# EAGLE design soil temp v0.1 (EAGLE 9.2.2)
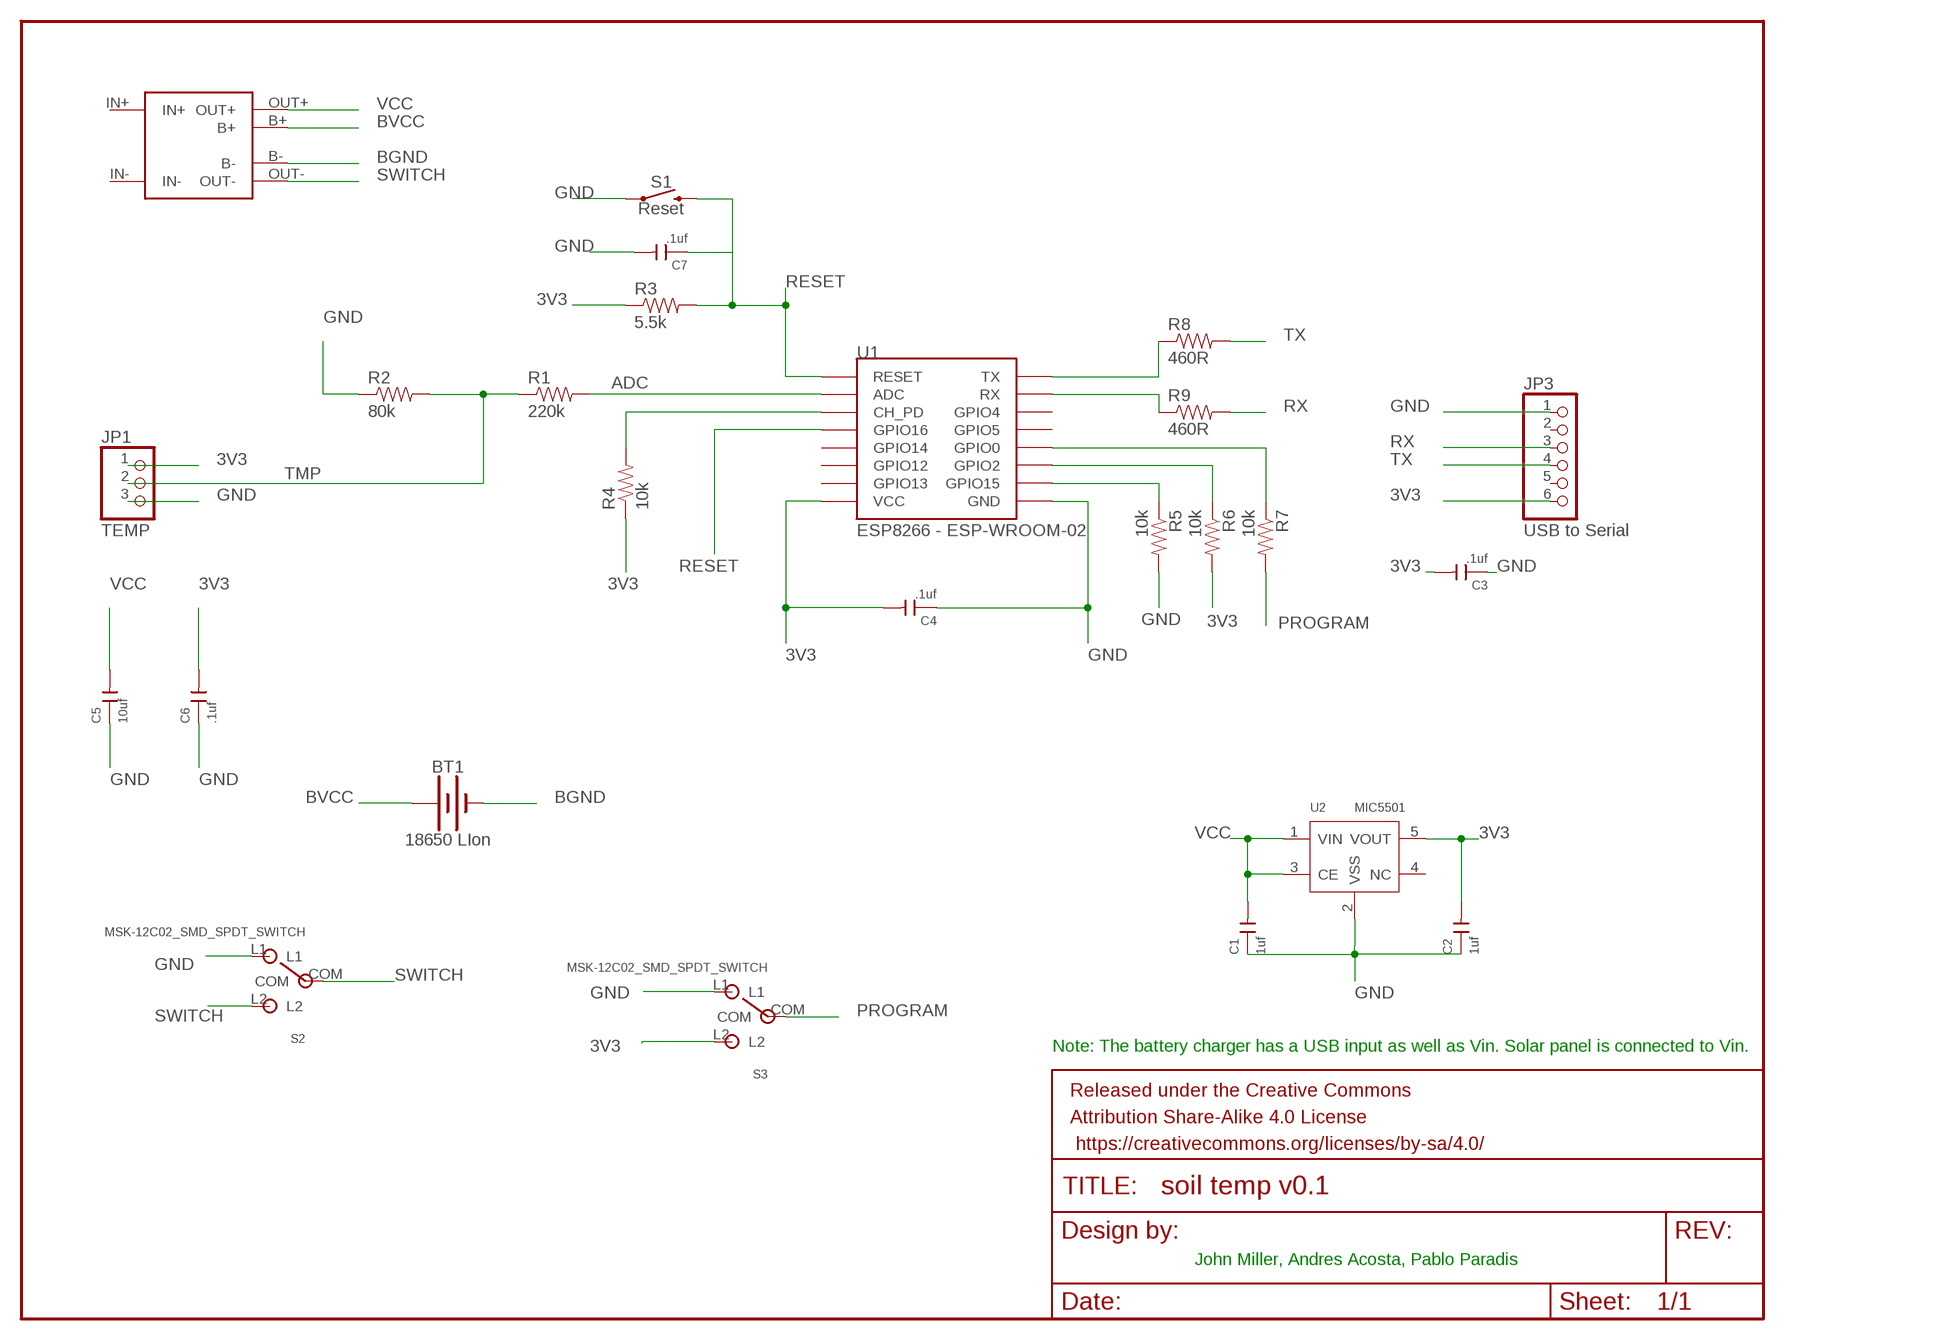
[diagram p0: schematic, sheet 1]

## Parts
BT1  18650 LIon  BATTERY-18650  [BATTERY_18650-HOLDER]
C1  1uf  CERAMIC-1UF-25V-10%-X7R(0805)  [C0805]
C2  1uf  CERAMIC-1UF-25V-10%-X7R(0805)  [C0805]
C3  .1uf  CERAMIC-1UF-25V-10%-X7R(0805)  [C0805]
C4  .1uf  CERAMIC-1UF-25V-10%-X7R(0805)  [C0805]
C5  10uf  CERAMIC-1UF-25V-10%-X7R(0805)  [C0805]
C6  .1uf  CERAMIC-1UF-25V-10%-X7R(0805)  [C0805]
C7  .1uf  CERAMIC-1UF-25V-10%-X7R(0805)  [C0805]
FRAME1  FRAME-LETTERNO_PACKAGE  [DUMMY]
JP1  TEMP  PINHD-1X3  [1X03]
JP3  USB to Serial  PINHD-1X6/90  [1X06/90]
R1  220k  RESISTOR0805  [R0805]
R2  80k  RESISTOR0805  [R0805]
R3  5.5k  RESISTOR0805  [R0805]
R4  10k  RESISTOR0805  [R0805]
R5  10k  RESISTOR0805  [R0805]
R6  10k  RESISTOR0805  [R0805]
R7  10k  RESISTOR0805  [R0805]
R8  460R  RESISTOR0805  [R0805]
R9  460R  RESISTOR0805  [R0805]
S1  Reset  MOMENTARY-SWITCH-SPST-SMD-6.2MM-TALL  [TACTILE_SWITCH_SMD_6.2MM_TALL]
S2  MSK-12C02_SMD_SPDT_SWITCH  [MSK-12C02]
S3  MSK-12C02_SMD_SPDT_SWITCH  [MSK-12C02]
U1  ESP8266 - ESP-WROOM-02  ESP12  [ESP12]
U2  MIC5501  PMIC-LDO-XC6204B332MR(SOT23-5)  [SOT-23-5]
U3  TP4056-MODULE  [TP4056-LITHIUM-PROTECTED-MODULE]

## Nets
3V3: C2.2 C3.2 C4.2 C6.2 JP1.1 JP3.6 R3.1 R4.1 R6.2 S3.L2 U1.VCC U2.5(VOUT)
ADC: R1.2 U1.ADC
BGND: BT1.GND@1(-) U3.B-
BVCC: BT1.PWR@1(+) U3.B+
GND: C1.1 C2.1 C3.1 C4.1 C5.1 C6.1 C7.2 JP1.3 JP3.1 R2.1 R5.2 S1.A2 S2.L1 S3.L1 U1.GND U2.2(VSS)
N$1: R4.2 U1.CH_PD
N$2: R5.1 U1.GPIO15
N$3: R6.1 U1.GPIO2
N$4: R7.1 U1.GPIO0
PROGRAM: R7.2 S3.COM
R2RX: R9.1 U1.RX
R2TX: R8.1 U1.TX
RESET: C7.1 R3.2 S1.B2 U1.GPIO16 U1.RESET
RX: JP3.3 R9.2
SWITCH: S2.COM S2.L2 U3.OUT-
TMP: JP1.2 R1.1 R2.2
TX: JP3.4 R8.2
VCC: C1.2 C5.2 U2.1(VIN) U2.3(CE) U3.OUT+
Unconnected: JP3.2 JP3.5 U1.GPIO4 U1.GPIO5 U1.GPIO12 U1.GPIO13 U1.GPIO14 U2.4(NC)

## Notes on the sheet
- Note: The battery charger has a USB input as well as Vin. Solar panel is connected to Vin.
- John Miller, Andres Acosta, Pablo Paradis

## Power pins joined to a net without a drawn wire
IN+: U3.IN+
IN-: U3.IN-

## Library data of the parts
BT1 = SparkFun-Batteries:BATTERY: Battery - Single Cell A variety of battery chemistries, sizes, and footprints. Device List: 20MM_PTH - Coin Cell Battery Holder - 20mm (PTH) <https://www.sparkfun.com/products/783> 6.8MM_PTH - Coin Cell Battery Holder - 6.8MM(SMD) <https://www.digikey.com/product-detail/en/seiko-instruments/MS621FE-FL11E/728-1057-ND/1889208?WT.srch=1&gclid=CNOQ5a6LzdQCFZS2wAodXCkE0g> 12MM_SMD - Coin Cell Battery Holder - 12mm (SMD) <https://www.sparkfun.com/products/10592> 12MM_PTH - Coin Cell Battery Holder - 12mm (PTH) <https://www.sparkfun.com/products/7948> 20MM_SMD - 20mm Coin Cell Battery Holder (SMD) (2 legs) Used on the Big Time Watch Kit <https://www.sparkfun.com/products/11734> 20MM_SMD_4LEGS - Coin Cell Battery Holder - 20mm (SMD) <https://www.sparkfun.com/products/11892> 20MM_SMD_4LEGS_OVERPASTE - Coin Cell Battery Holder - 20mm (SMD) <https://www.sparkfun.com/products/11892> (Over-paste on the legs) 24.5MM_PTH - Coin Cell Battery Holder - 24.5mm (PTH) <https://www.sparkfun.com/products/8863> 9V - 9V Battery Holder - PC Mount Used on the SparkFun SparkPunk Sound Kit <https://www.sparkfun.com/products/11177> and SparkFun SparkPunk Sequencer Kit <https://www.sparkfun.com/products/12707> 18650 - Battery Holder - 18650 (PTH) <https://www.sparkfun.com/products/13113> AA - Battery Holder - 1xAA (PTH) <https://www.sparkfun.com/products/7949> AAA - Battery Holder - 1xAAA (PTH) <https://www.sparkfun.com/products/12718> AA_KIT - Battery Holder - 1xAA (PTH) <https://www.sparkfun.com/products/7949> Special kit package - pads only have exposed copper on one side of the board. AAA_KIT - Battery Holder - 1xAAA (PTH) <https://www.sparkfun.com/products/12718> Special kit package - pads only have exposed copper on one side of the board.; PROD_ID: BATT-12327; SF_SKU: PRT-13113
C1 C2 = Seeed-Capacitor:CERAMIC-1UF-25V-10%-X7R(0805): 302010179; MPN: CC0805KKX7R8BB105
C3-C7 = Seeed-Capacitor:CERAMIC-1UF-25V-10%-X7R(0805): 302010179; MPN: CC0805KKX7R8BB105; VALUE: 1uf
FRAME1 = SparkFun-Aesthetics:FRAME-LETTER: Schematic Frame - Letter Standard 8.5x11 US Letter frame; DESIGNER: Nobody; VERSION: v01
JP1 = pinhead:PINHD-1X3: PIN HEADER
JP3 = pinhead:PINHD-1X6: PIN HEADER
R1-R9 = BeagleBone_Blue_R3:RESISTOR
S1 = SparkFun-Switches:MOMENTARY-SWITCH-SPST: Momentary Switch (Pushbutton) - SPST Normally-open (NO) SPST momentary switches (buttons, pushbuttons). Variants PTH-12MM - 12mm square, through-hole Momentary Pushbutton Switch - 12mm Square <https://www.sparkfun.com/products/9190> (COM-09190) PTH-6.0MM, PTH-6.0MM-KIT - 6.0mm square, through-hole Mini Pushbutton Switch <https://www.sparkfun.com/products/97> (COM-00097) KIT package intended for soldering kit's - only one side of pads' copper is exposed. PTH-RIGHT-ANGLE-KIT - Right-angle, through-hole Right Angle Tactile Button <https://www.sparkfun.com/products/10791> - Used on SparkFun BigTime Watch Kit <https://www.sparkfun.com/products/11734> SMD-12MM - 12mm square, surface-mount Tactile Button - SMD (12mm) <https://www.sparkfun.com/products/12993> (COM-12993) Used on SparkFun PicoBoard <https://www.sparkfun.com/products/11888> SMD-4.5MM - 4.5mm Square Trackball Switch Used on SparkFun Blackberry Trackballer Breakout <https://www.sparkfun.com/products/13169> SMD-4.6MMX2.8MM - 4.60mm x 2.80mm, surface mount Used on SparkFun SAMD21 Mini Breakout <https://www.sparkfun.com/products/13664> SMD-5.2MM, SMD-5.2-REDUNDANT - 5.2mm square, surface-mount Mini Pushbutton Switch - SMD <https://www.sparkfun.com/products/8720> (COM-08720) Used on Arduino Pro Mini <https://www.sparkfun.com/products/11114> REDUNDANT package connects both switch circuits together SMD-6.0X3.5MM - 6.0 x 3.5mm, surface mount Momentary Reset Switch SMD <https://www.sparkfun.com/products/8229> (COM-08229) SMD-6.2MM-TALL - 6.2mm square, surface mount Tactile Button - SMD (6mm) <https://www.sparkfun.com/products/12992> Used on SparkFun Digital Sandbox <https://www.sparkfun.com/products/12651> SMD-RIGHT-ANGLE - Right-angle, surface mount Used on SparkFun Block for Intel® Edison - Arduino <https://www.sparkfun.com/products/13036>; PROD_ID: SWCH-11966; SF_SKU: COM-12992
S2 S3 = MSK-12C02 SMD Micro Slider Switch SPDT:MSK-12C02_SMD_SPDT_SWITCH: Footprint of the VIMEX MSK-12C02 SPDT SMD Switch Created by mzst on 17-Jan-2016
U1 = esp8266modules:ESP12: ESP8266 Wifi module 12
U2 = Seeed-IC:PMIC-LDO-XC6204B332MR(SOT23-5): 310030046; MPN: XC6204B332MR; VALUE: XC6204B332MR-SOT23-5
U3 = userlib:TP4056-MODULE

## Board
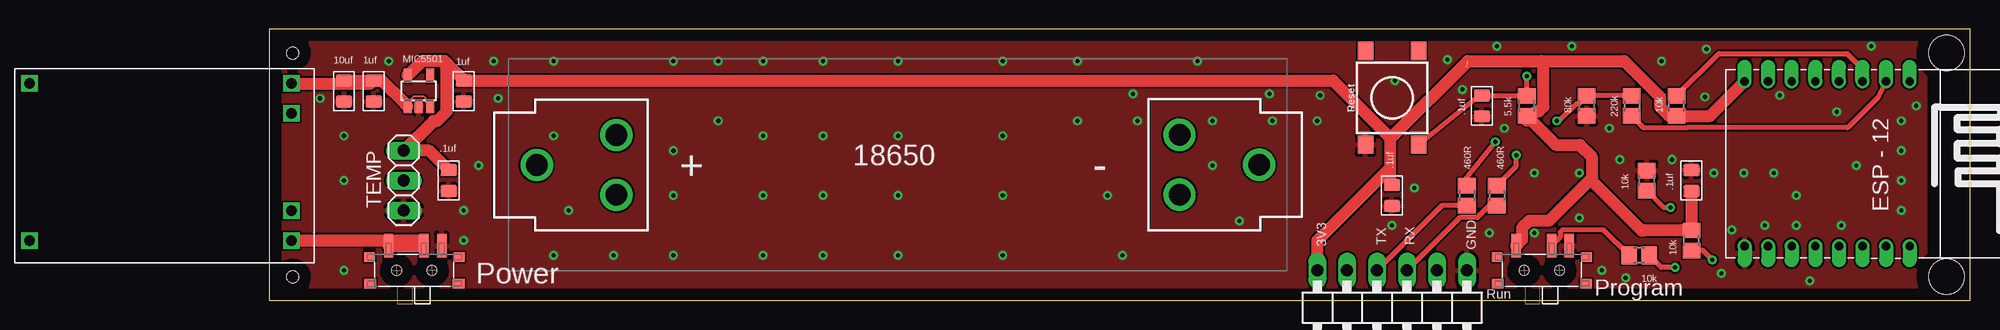
[diagram p1: board, top side]
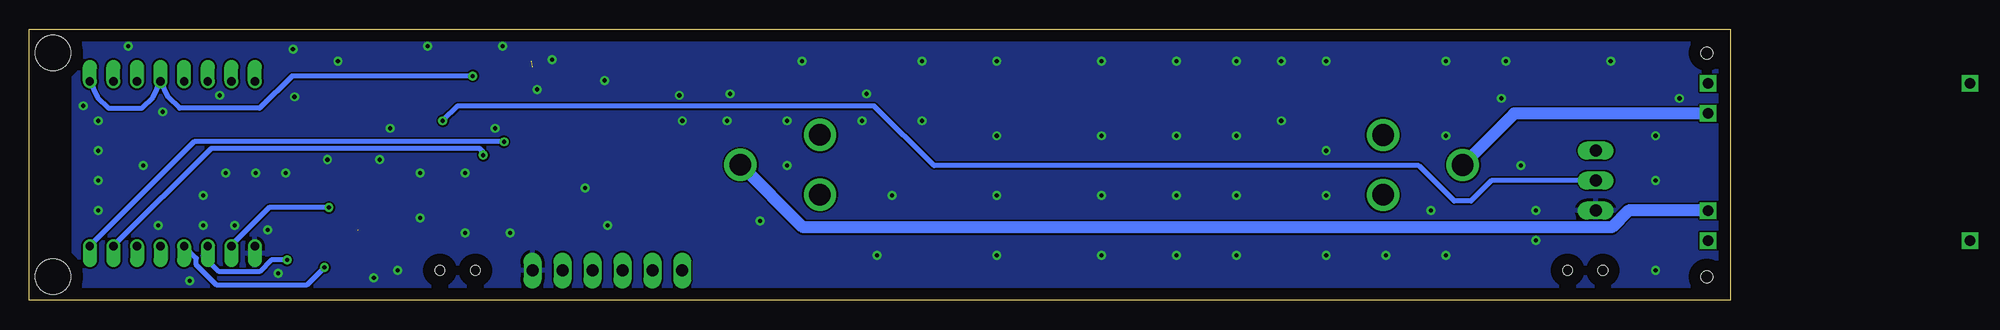
[diagram p2: board, bottom side, seen from below]

Size 144.27 x 23 mm. Coordinates in mm from the lower left corner, seen from the top.
Outline: 0,0 144.27,0 144.27,23 0,23 0,0
Copper layers (1*16): Top 0.035mm / dielectric 1.5mm / Bottom 0.035mm
Design rules "default": minimum track width 6mil, minimum drill 0.35mm, track to track 6mil, track to pad 6mil, pad to pad 6mil, via to via 6mil, smd to smd 6mil, copper to edge 40mil, drill to drill 6mil, minimum pad ring 10mil, minimum via ring 8mil, stop-mask expansion 4mil, vias tented up to drill 0mil, thermal gap 10mil
Holes 1 mm at 2,21 2,2
Holes 3 mm at 142.27,2 142.27,21

### Footprints (pad centres in the part's own frame; a part is rotated, then mirrored left to right if it is on the bottom)
BATTERY_18650-HOLDER = drill 1.829: GND@1 30.628,0.01; GND@2 23.88,2.55; GND@3 23.88,-2.53; PWR@1 -30.628,-0.01; PWR@2 -23.88,2.53; PWR@3 -23.88,-2.55
C0805 = smd 1.397 x 1.016: 1 0,0.889; 2 0,-0.889
1X03 = drill 1.016 long: 1 -2.54,0; 2 0,0; 3 2.54,0
1X06/90 = drill 1.016 long: 1 -6.35,-3.81; 2 -3.81,-3.81; 3 -1.27,-3.81; 4 1.27,-3.81; 5 3.81,-3.81; 6 6.35,-3.81
R0805 = smd 1.3 x 1.5: 1 -0.85,0; 2 0.85,0
TACTILE_SWITCH_SMD_6.2MM_TALL = smd 1.55 x 1.3: A1 -3.975,-2.25; A2 3.975,-2.25; B1 -3.975,2.25; B2 3.975,2.25
MSK-12C02 = smd 0.8 x 2: COM 0.823,2.1; L1 2.323,2.1; L2 -2.177,2.1 | smd 1 x 0.8: GND@1 -3.75,-1.125; GND@4 3.75,-1.125 | smd 0.9 x 0.8: GND@2 -3.8,1.125; GND@3 3.8,1.125 | hole 0.8: -1.5,0; 1.5,0
ESP12 = drill 0.7 offset: ADC -7.1,3.8; CH_PD -7.1,1.8; GND 6.9,-8.2; GPIO0 6.9,-2.2; GPIO2 6.9,-4.2; GPIO4 6.9,1.8; GPIO5 6.9,-0.2; GPIO12 -7.1,-4.2; GPIO13 -7.1,-6.2; GPIO14 -7.1,-2.2; GPIO15 6.9,-6.2; GPIO16 -7.1,-0.2; RESET -7.1,5.8; RX 6.9,3.8; TX 6.9,5.8; VCC -7.1,-8.2
SOT-23-5 = smd 0.69 x 1.2: 1 -0.95,-1.3; 2 0,-1.3; 3 0.95,-1.3; 4 0.95,1.3; 5 -0.95,1.3
TP4056-LITHIUM-PROTECTED-MODULE = drill 0.9 square: B+ 10.795,4.445; B- 10.795,-3.81; IN+ -11.43,6.985; IN- -11.43,-6.35; OUT+ 10.795,6.985; OUT- 10.795,-6.35

### Placement (x,y rotation side)
BT1  53.34,11.5 0 top
C1  8.89,17.78 180 top
C2  16.51,17.78 180 top
C3  15.24,10.16 180 top
C4  95.25,8.89 180 top
C5  6.35,17.78 180 top
C6  120.65,10.16 0 top
C7  102.87,16.51 0 top
FRAME1  -40.64,46.99 0 top  (outside the outline)
JP1  11.43,10.16 270 top
JP3  95.25,-1.27 180 top
R1  115.57,16.51 270 top
R2  111.76,16.51 90 top
R3  106.68,16.51 90 top
R4  119.38,16.51 90 top
R5  116.84,10.16 90 top
R6  120.65,5.08 90 top
R7  116.2,3.81 180 top
R8  101.6,8.89 270 top
R9  104.14,8.89 270 top
S1  95.25,17.2 270 top
S2  12.32,2.54 0 top
S3  107.95,2.54 0 top
U1  133.35,11.5 270 top
U2  12.7,17.78 0 top
U3  -8.89,11.43 0 top

### Tracks (layer width: path | path; a pad name or v marks a point on that pad's centre or on a via)
3V3  (2 unrouted)
  Top 0.406: C2.2 16.32,18.86 16.32,18.72 16.51,18.72 | 95.25,13.59 95.12,13.76 95.07,13.84 | 119.17,15.66 R4.1 | C4.2 95.25,10.16 | 101.6,19.78 101.44,19.78
  Top 1.016: U2.5 11.77,19.08 13.03,20.34 14.89,20.34 15.07,20.15 | 15.07,20.15 16.51,18.72 | C2.2 90.24,18.67 95.07,13.84 95.07,11.25 | 95.07,11.25 95.07,9.96 C4.2 | 112.19,10.15 116.41,5.93 | 112.19,10.15 112.19,12.2 111.19,13.2 109.14,13.2 R3.1 106.68,15.24 107.49,16.05 107.7,16.05 108.09,16.44 108.09,20.18 107.95,20.32 | R4.1 122.21,15.66 U1.VCC | 119.17,15.66 118.75,15.66 117.97,16.44 117.97,17.29 114.94,20.32 107.95,20.32 | C6.2 R6.2 116.63,5.93 116.59,5.97 116.41,5.97 | JP3.6 88.9,5.08 95.07,11.25 | C3.2 13.59,12.7 JP1.1 13.95,15.22 14.27,15.22 15.07,16.02 15.07,20.15 | 95.12,13.76 101.68,20.32 107.95,20.32 | 112.19,10.15 111.95,10.15 108.55,6.75 106.89,6.75 106.28,6.14 106.28,5.14 S3.L2
ADC
  Top 0.406: U1.ADC 136.51,17.26 133.92,14.67 | 133.92,14.67 133.9,14.65 | 133.92,14.67 120.29,14.67 120.28,14.65 116.58,14.65 R1.2
BGND
  Bottom 1.016: U3.B- 8.66,7.62 10.08,6.2 78.66,6.2 BT1.GND@1
BVCC
  Bottom 1.016: U3.B+ 18.33,15.88 BT1.PWR@1
GND  (via drill 0.35)
  Top 0.406: S2.L1 14.64,5.08 | R5.2 117.14,10.71 | 94.97,8 C4.1
  other vias: 95.25,6.35 114.55,11.94 119,11.94 113.67,14.61 6.35,13.97 16.51,7.62 19.43,17.14 38.1,15.24 53.34,8.89 68.58,15.24 115.06,1.91 123.19,2.29 130.68,1.65 129.54,8.89 138.43,12.7 16.51,5.08 4.32,17.14 34.29,12.7 34.29,8.89 41.91,8.89 46.99,13.97 46.99,8.89 53.34,13.97 62.23,13.97 62.23,8.89 62.23,3.81 53.34,3.81 46.99,3.81 41.91,3.81 41.91,13.97 34.29,3.81 29.21,3.81 24.13,3.81 25.4,7.62 17.78,11.43 24.13,13.97 6.35,10.16 6.35,2.54 10.16,20.32 19.05,20.32 24.13,20.32 34.29,20.32 38.1,20.32 41.91,20.32 46.99,20.32 53.34,20.32 62.23,20.32 68.58,20.32 78.74,20.32 84.84,17.53 80.01,15.24 85.09,15.24 73.66,15.24 73.28,17.53 89.15,17.4 88.9,15.24 95.5,18.67 101.22,17.91 99.95,20.45 104.78,14.61 97.16,9.53 107.31,10.79 107.31,5.71 111.12,10.79 122.56,10.79 125.09,10.79 127.64,10.79 133.35,6.35 129.54,6.35 126.87,6.35 134.62,11.43 138.43,7.62 138.43,15.24 132.97,16 139.7,16.51 138.43,10.16 113.03,2.54 72.39,3.81 71.12,8.89 82.3,6.73 80.01,11.43 135.89,21.59 121.92,21.34 118.11,20.32 110.49,21.59 104.14,21.59 121.79,17.27 128.14,17.4 124.08,5.97 103.5,5.71 111.12,6.99
  pour Top: 0,0 140.46,0 140.46,23 0,23
  pour Bottom: 0,23 0,0 140.46,0 140.46,23
N$1
  Top 0.406: R4.2 122.97,20.95 133.86,20.95 135.15,19.66 U1.CH_PD
N$2  (via drill 0.35)
  Top 0.406: R5.1 118.28,7.87 v118.87,7.87
  Bottom 0.406: U1.GPIO15 127.15,4.68 123.95,7.87 v118.87,7.87
N$3  (via drill 0.35)
  Top 0.406: R6.1 121.61,4.23 122.42,3.43 v122.43,3.43
  Bottom 0.406: v122.43,3.43 123.76,3.43 124.75,2.43 128.16,2.43 129.54,3.81 129.15,4.2 U1.GPIO2
N$4  (via drill 0.35)
  Top 0.406: v119.25,2.79 118.07,2.79 R7.1
  Bottom 0.406: v119.25,2.79 120.78,1.27 128.38,1.27 130.11,3 130.11,3.56 U1.GPIO0
PROGRAM
  Top 0.406: S3.COM 109.52,5.38 109.52,5.79 109.73,6 113.17,6 R7.2
R2RX  (via drill 0.35)
  Top 0.406: v105.79,12.32 105.79,11.39 R9.1
  Bottom 0.406: U1.RX 128.86,12.89 106.1,12.89 105.79,12.58 v105.79,12.32
R2TX  (via drill 0.35)
  Top 0.406: R8.1 101.56,10.45 v104.01,13.46
  Bottom 0.406: v104.01,13.46 130.29,13.46 U1.TX
RESET  (via drill 0.35)
  Top 0.406: v106.68,19.05 R3.2 C7.1 102.62,17.4 S1.B2
  Bottom 0.406: U1.RESET 138.51,17.26 137.55,16.3 134.75,16.3 133.79,17.26 U1.GPIO16 132.51,17.26 131.55,16.3 124.75,16.3 122,19.05 v106.68,19.05
RX
  Top 0.406: JP3.3 101.01,7.03 102.5,7.03 103.5,8.04 R9.2
SWITCH
  Top 0.152: S2.COM 12.7,4.64 10.6,4.64 10.16,5.08
  Top 0.406: 10.14,4.42 S2.L2
  Top 1.016: U3.OUT- 10.16,5.08 12.7,5.08 | S2.L2 12.7,4.64
TMP  (via drill 0.35)
  Top 0.406: R1.1 R2.2 111.07,16.67 110.86,16.67 109.44,15.24 v109.22,15.24
  Bottom 0.406: JP1.2 20.26,10.16 22,8.42 23.43,8.42 26.43,11.43 67.55,11.43 72.62,16.51 105.41,16.51 107.95,16.51 v109.22,15.24
TX
  Top 0.406: 93.98,2.96 JP3.4 99.48,8.04 R8.2
VCC
  Top 0.152: C1.2 8.64,18.41 | 11.57,16.66 11.61,16.66 12.26,17.31 13.14,17.31 13.27,17.18 13.27,16.86 U2.3
  Top 0.406: 6.1,18.41 C5.2
  Top 1.016: U3.OUT+ 8.64,18.41 | U2.1 11.57,16.66 9.56,18.67 C1.2 C5.2

### Text on the board
tNames: 18650 | 3V3 | TX | RX | GND | Power | Run | Program